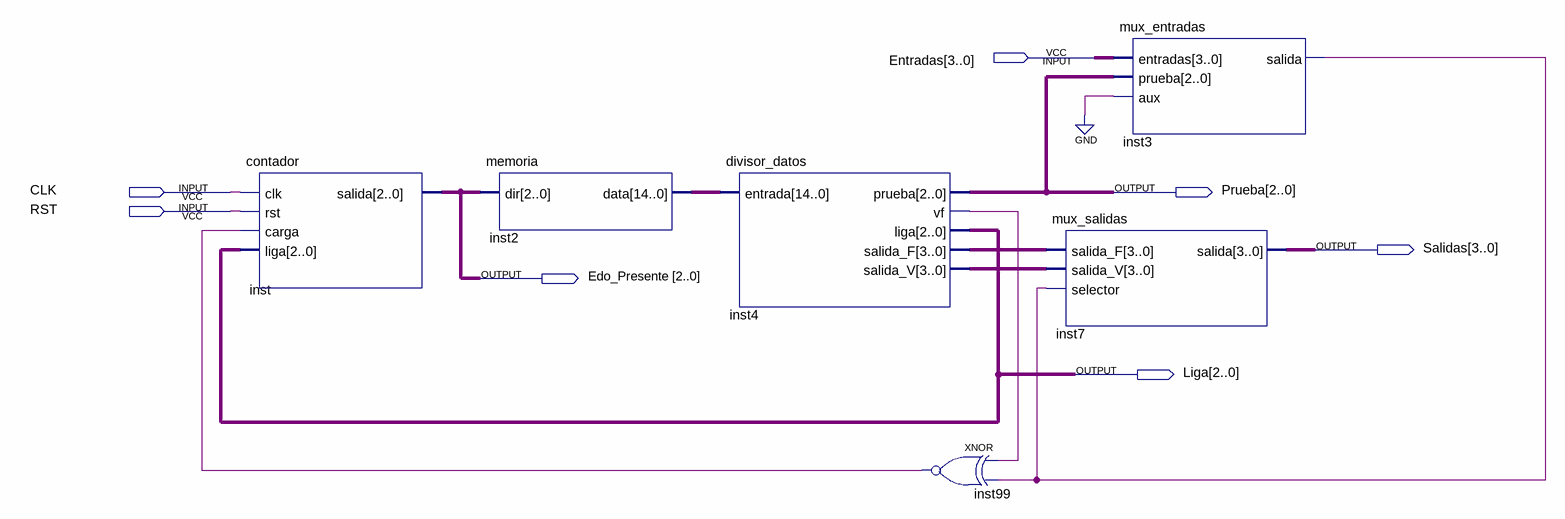
[diagram p0: schematic sheet]
// Quartus schematic practica5.bdf as structural Verilog: 6 symbols, 7 pins
module practica5 (
  input  [3:0] Entradas,
  input  CLK,
  input  RST,
  output [2:0] Prueba,
  output [3:0] Salidas,
  output [2:0] Edo_Presente,
  output [2:0] Liga
);

  wire inst3_salida, inst4_vf, inst99_out;
  wire [3:0] inst4_salida_f, inst4_salida_v;
  wire [14:0] inst2_data;

  contador inst (.clk(CLK), .rst(RST), .carga(inst99_out), .liga(Liga), .salida(Edo_Presente));
  memoria inst2 (.dir(Edo_Presente), .data(inst2_data));
  divisor_datos inst4 (
    .entrada(inst2_data), .prueba(Prueba), .vf(inst4_vf), .liga(Liga), .salida_F(inst4_salida_f),
    .salida_V(inst4_salida_v));
  xnor inst99 (inst99_out, inst4_vf, inst3_salida);
  mux_salidas inst7 (.salida_F(inst4_salida_f), .salida_V(inst4_salida_v), .selector(inst3_salida), .salida(Salidas));
  mux_entradas inst3 (.entradas(Entradas), .prueba(Prueba), .aux(1'b0), .salida(inst3_salida));
endmodule
